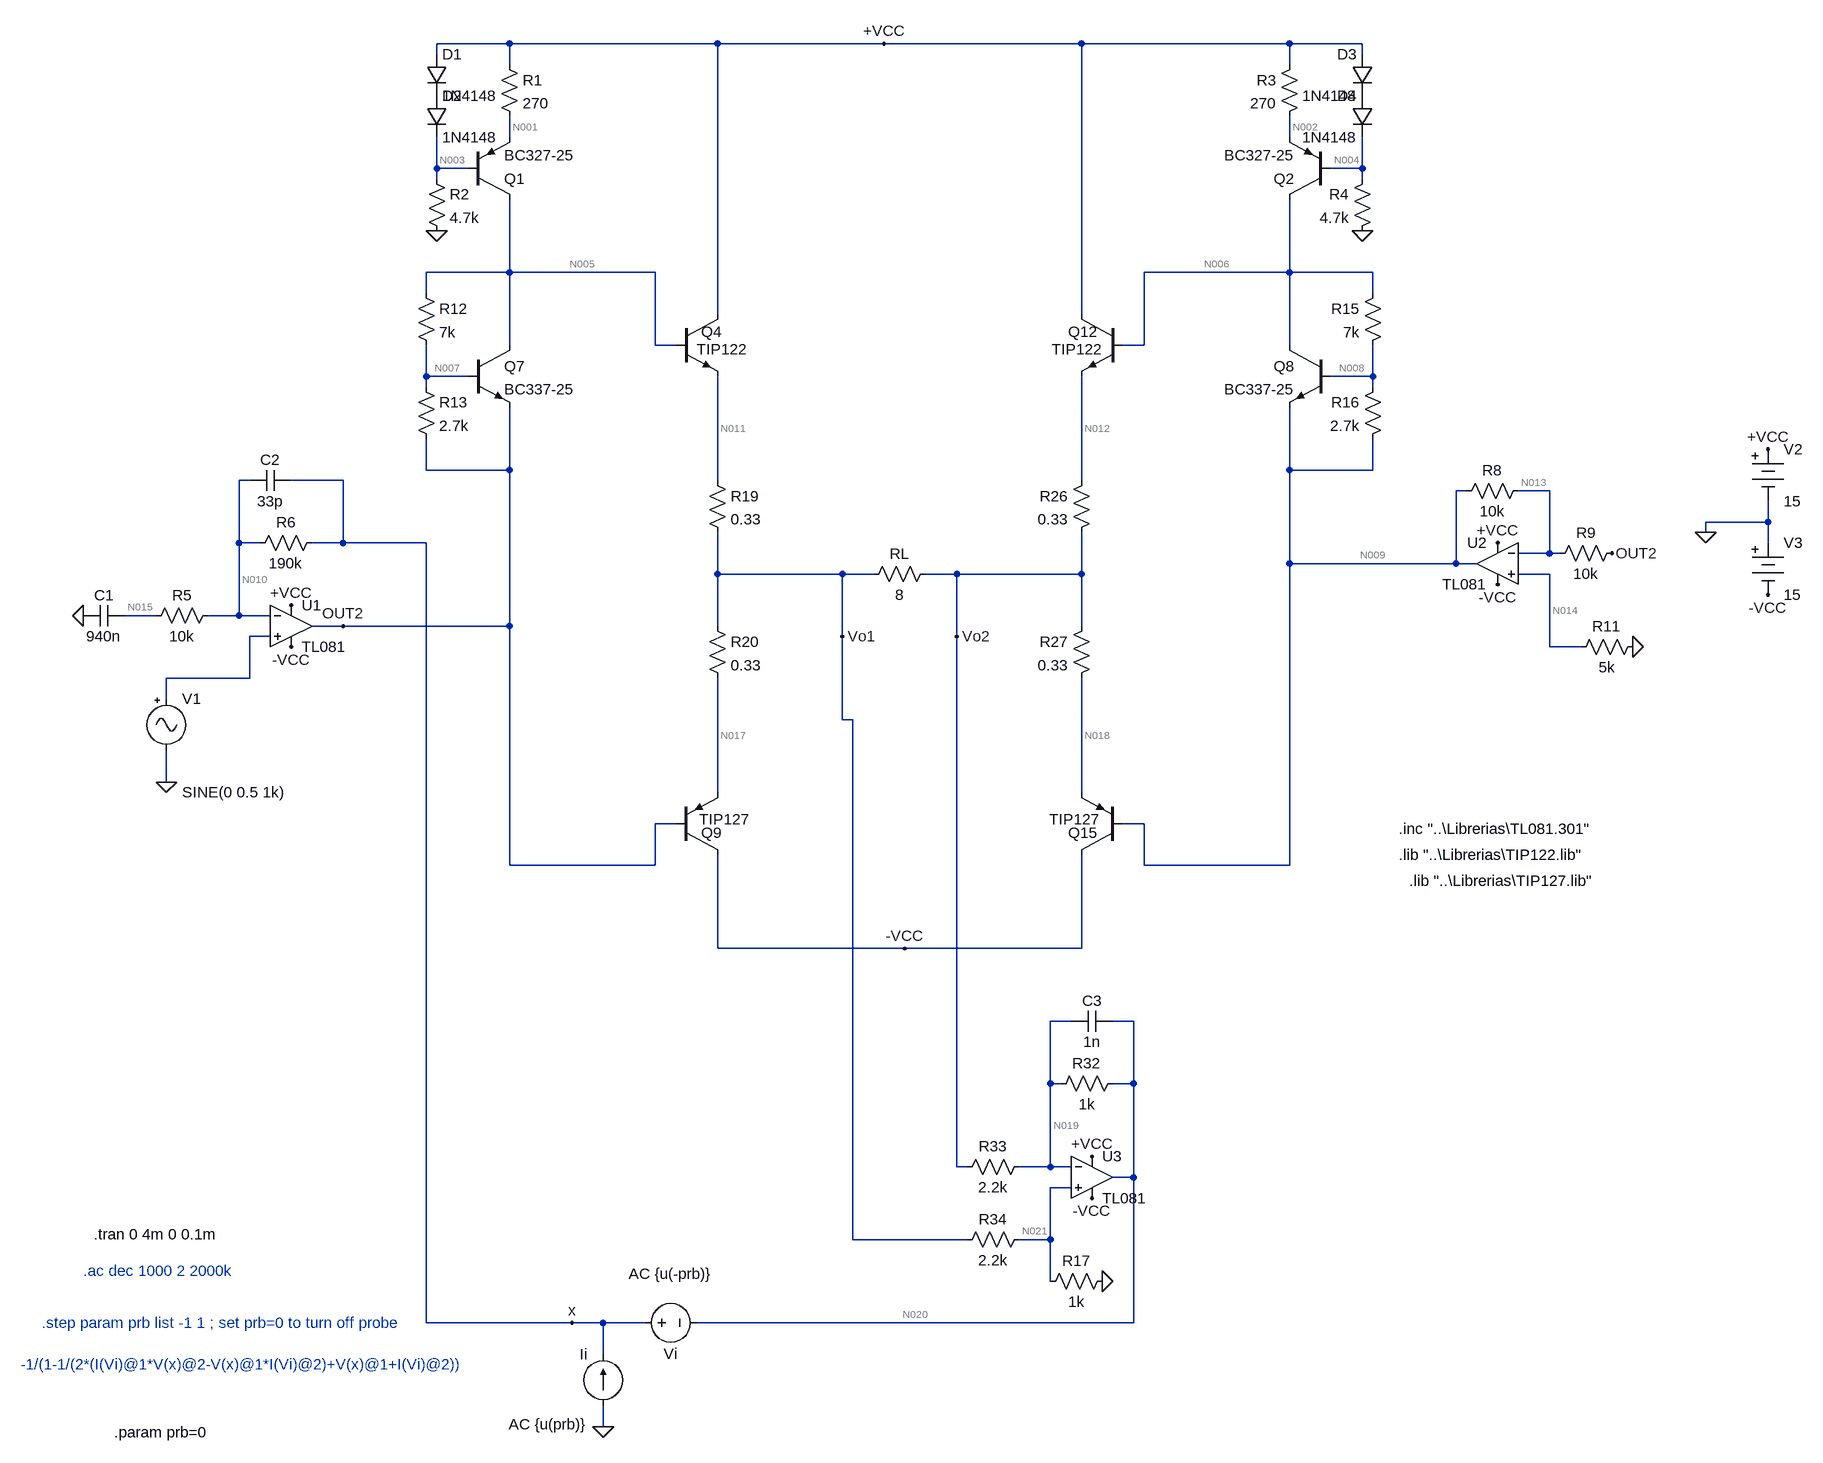
[diagram p0: schematic Amplificador.asc]
Amplificador.asc, the LTspice schematic file:
Version 4
SHEET 1 1564 2024
WIRE -608 -128 -720 -128
WIRE -288 -128 -608 -128
WIRE -32 -128 -288 -128
WIRE 272 -128 -32 -128
WIRE 592 -128 272 -128
WIRE 704 -128 592 -128
WIRE -720 -112 -720 -128
WIRE 704 -112 704 -128
WIRE -608 -96 -608 -128
WIRE 592 -96 592 -128
WIRE -608 16 -608 -16
WIRE 592 16 592 -16
WIRE -720 64 -720 16
WIRE -672 64 -720 64
WIRE 704 64 704 16
WIRE 704 64 656 64
WIRE -720 80 -720 64
WIRE 704 80 704 64
WIRE -608 224 -608 112
WIRE -608 224 -736 224
WIRE -384 224 -608 224
WIRE 592 224 592 112
WIRE 592 224 368 224
WIRE 720 224 592 224
WIRE -736 256 -736 224
WIRE 720 256 720 224
WIRE -288 288 -288 -128
WIRE 272 288 272 -128
WIRE -608 336 -608 224
WIRE -384 336 -384 224
WIRE -352 336 -384 336
WIRE 368 336 368 224
WIRE 368 336 336 336
WIRE 592 336 592 224
WIRE -736 384 -736 336
WIRE -672 384 -736 384
WIRE 720 384 720 336
WIRE 720 384 656 384
WIRE -736 400 -736 384
WIRE 720 400 720 384
WIRE -736 528 -736 480
WIRE -608 528 -608 432
WIRE -608 528 -736 528
WIRE 592 528 592 432
WIRE 720 528 720 480
WIRE 720 528 592 528
WIRE -1008 544 -1024 544
WIRE -864 544 -944 544
WIRE -288 544 -288 384
WIRE 272 544 272 384
WIRE 864 560 848 560
WIRE 992 560 944 560
WIRE 1328 608 1328 576
WIRE 1328 608 1232 608
WIRE 1232 624 1232 608
WIRE -1024 640 -1024 544
WIRE -992 640 -1024 640
WIRE -864 640 -864 544
WIRE -864 640 -912 640
WIRE -736 640 -864 640
WIRE 1328 640 1328 608
WIRE 992 656 992 560
WIRE 992 656 944 656
WIRE 1008 656 992 656
WIRE 592 672 592 528
WIRE 848 672 848 560
WIRE 848 672 592 672
WIRE 880 672 848 672
WIRE -288 688 -288 624
WIRE -96 688 -288 688
WIRE -48 688 -96 688
WIRE 80 688 32 688
WIRE 272 688 272 624
WIRE 272 688 80 688
WIRE 992 688 944 688
WIRE -1152 752 -1200 752
WIRE -1024 752 -1024 640
WIRE -1024 752 -1072 752
WIRE -976 752 -1024 752
WIRE -864 768 -912 768
WIRE -608 768 -608 528
WIRE -608 768 -864 768
WIRE -288 768 -288 688
WIRE 272 768 272 688
WIRE -976 784 -1008 784
WIRE -96 784 -96 688
WIRE 80 784 80 688
WIRE 992 800 992 688
WIRE 1040 800 992 800
WIRE -1008 848 -1008 784
WIRE -1008 848 -1136 848
WIRE -1136 880 -1136 848
WIRE -96 912 -96 784
WIRE -80 912 -96 912
WIRE -1136 1008 -1136 960
WIRE -288 1024 -288 848
WIRE 272 1024 272 848
WIRE -352 1072 -384 1072
WIRE 368 1072 336 1072
WIRE -608 1136 -608 768
WIRE -384 1136 -384 1072
WIRE -384 1136 -608 1136
WIRE 368 1136 368 1072
WIRE 592 1136 592 672
WIRE 592 1136 368 1136
WIRE -288 1264 -288 1120
WIRE 0 1264 -288 1264
WIRE 272 1264 272 1120
WIRE 272 1264 0 1264
WIRE 256 1376 224 1376
WIRE 352 1376 320 1376
WIRE 224 1472 224 1376
WIRE 240 1472 224 1472
WIRE 352 1472 352 1376
WIRE 352 1472 320 1472
WIRE 80 1600 80 784
WIRE 96 1600 80 1600
WIRE 224 1600 224 1472
WIRE 224 1600 176 1600
WIRE 256 1600 224 1600
WIRE 352 1616 352 1472
WIRE 352 1616 320 1616
WIRE 256 1632 224 1632
WIRE -80 1712 -80 912
WIRE 96 1712 -80 1712
WIRE 224 1712 224 1632
WIRE 224 1712 176 1712
WIRE 224 1776 224 1712
WIRE -736 1840 -736 640
WIRE -512 1840 -736 1840
WIRE -464 1840 -512 1840
WIRE -400 1840 -464 1840
WIRE 352 1840 352 1616
WIRE 352 1840 -320 1840
WIRE -464 1888 -464 1840
WIRE -464 2000 -464 1968
FLAG -720 160 0
FLAG -864 768 OUT2
FLAG 1088 656 OUT2
FLAG 704 160 0
FLAG 1232 624 0
FLAG 1328 496 +VCC
FLAG 1328 720 -VCC
FLAG -944 736 +VCC
FLAG 912 640 +VCC
FLAG 288 1584 +VCC
FLAG -32 -128 +VCC
FLAG -96 784 Vo1
FLAG 80 784 Vo2
FLAG -464 2000 0
FLAG -512 1840 x
FLAG 1120 800 0
FLAG 304 1776 0
FLAG 0 1264 -VCC
FLAG -944 800 -VCC
FLAG 288 1648 -VCC
FLAG 912 704 -VCC
FLAG -1136 1008 0
FLAG -1264 752 0
SYMBOL pnp -672 112 M180
SYMATTR InstName Q1
SYMATTR Value BC327-25
SYMBOL diode -736 -112 R0
SYMATTR InstName D1
SYMATTR Value 1N4148
SYMBOL diode -736 -48 R0
SYMATTR InstName D2
SYMATTR Value 1N4148
SYMBOL res -624 -112 R0
SYMATTR InstName R1
SYMATTR Value 270
SYMBOL res -736 64 R0
SYMATTR InstName R2
SYMATTR Value 4.7k
SYMBOL Opamps\\opamp2 -944 704 R0
SYMATTR InstName U1
SYMATTR Value TL081
SYMATTR SpiceModel TL081
SYMBOL Opamps\\opamp2 912 608 M0
SYMATTR InstName U2
SYMATTR Value TL081
SYMATTR SpiceModel TL081
SYMBOL res -896 624 R90
WINDOW 0 0 56 VBottom 2
WINDOW 3 32 56 VTop 2
SYMATTR InstName R6
SYMATTR Value 190k
SYMBOL res 960 544 R90
WINDOW 0 0 56 VBottom 2
WINDOW 3 32 56 VTop 2
SYMATTR InstName R8
SYMATTR Value 10k
SYMBOL res 1104 640 R90
WINDOW 0 0 56 VBottom 2
WINDOW 3 32 56 VTop 2
SYMATTR InstName R9
SYMATTR Value 10k
SYMBOL npn -672 336 R0
SYMATTR InstName Q7
SYMATTR Value BC337-25
SYMBOL res -752 240 R0
SYMATTR InstName R12
SYMATTR Value 7k
SYMBOL res -752 384 R0
SYMATTR InstName R13
SYMATTR Value 2.7k
SYMBOL npn -352 288 R0
WINDOW 0 39 27 Left 2
WINDOW 3 32 54 Left 2
SYMATTR InstName Q4
SYMATTR Value TIP122
SYMATTR Prefix X
SYMBOL res -304 528 R0
SYMATTR InstName R19
SYMATTR Value 0.33
SYMBOL res -304 752 R0
SYMATTR InstName R20
SYMATTR Value 0.33
SYMBOL pnp -352 1120 M180
WINDOW 0 39 34 Left 2
WINDOW 3 36 55 Left 2
SYMATTR InstName Q9
SYMATTR Value TIP127
SYMATTR Prefix X
SYMBOL pnp 656 112 R180
SYMATTR InstName Q2
SYMATTR Value BC327-25
SYMBOL diode 720 -112 M0
SYMATTR InstName D3
SYMATTR Value 1N4148
SYMBOL diode 720 -48 M0
SYMATTR InstName D4
SYMATTR Value 1N4148
SYMBOL res 608 -112 M0
SYMATTR InstName R3
SYMATTR Value 270
SYMBOL res 720 64 M0
SYMATTR InstName R4
SYMATTR Value 4.7k
SYMBOL npn 656 336 M0
SYMATTR InstName Q8
SYMATTR Value BC337-25
SYMBOL res 736 240 M0
SYMATTR InstName R15
SYMATTR Value 7k
SYMBOL res 736 384 M0
SYMATTR InstName R16
SYMATTR Value 2.7k
SYMBOL npn 336 288 M0
WINDOW 0 39 27 Left 2
WINDOW 3 32 54 Left 2
SYMATTR InstName Q12
SYMATTR Value TIP122
SYMATTR Prefix X
SYMBOL res 288 528 M0
SYMATTR InstName R26
SYMATTR Value 0.33
SYMBOL res 288 752 M0
SYMATTR InstName R27
SYMATTR Value 0.33
SYMBOL pnp 336 1120 R180
WINDOW 0 39 34 Left 2
WINDOW 3 36 55 Left 2
SYMATTR InstName Q15
SYMATTR Value TIP127
SYMATTR Prefix X
SYMBOL res 48 672 R90
WINDOW 0 0 56 VBottom 2
WINDOW 3 32 56 VTop 2
SYMATTR InstName RL
SYMATTR Value 8
SYMBOL Opamps\\opamp2 288 1552 R0
SYMATTR InstName U3
SYMATTR Value TL081
SYMATTR SpiceModel TL081
SYMBOL res 336 1456 R90
WINDOW 0 0 56 VBottom 2
WINDOW 3 32 56 VTop 2
SYMATTR InstName R32
SYMATTR Value 1k
SYMBOL res 192 1584 R90
WINDOW 0 0 56 VBottom 2
WINDOW 3 32 56 VTop 2
SYMATTR InstName R33
SYMATTR Value 2.2k
SYMBOL res 192 1696 R90
WINDOW 0 0 56 VBottom 2
WINDOW 3 32 56 VTop 2
SYMATTR InstName R34
SYMATTR Value 2.2k
SYMBOL Misc\\battery 1328 480 R0
WINDOW 123 0 0 Left 2
WINDOW 39 0 0 Left 2
SYMATTR InstName V2
SYMATTR Value 15
SYMBOL Misc\\battery 1328 624 R0
WINDOW 123 0 0 Left 2
WINDOW 39 0 0 Left 2
SYMATTR InstName V3
SYMATTR Value 15
SYMBOL cap 256 1360 M90
WINDOW 0 0 32 VBottom 2
WINDOW 3 32 32 VTop 2
SYMATTR InstName C3
SYMATTR Value 1n
SYMBOL current -464 1968 R180
WINDOW 0 24 80 Left 2
WINDOW 3 24 0 Left 2
WINDOW 123 24 -28 Left 2
WINDOW 39 0 0 Left 2
SYMATTR InstName Ii
SYMATTR Value ""
SYMATTR Value2 AC {u(prb)}
SYMBOL voltage -416 1840 R270
WINDOW 0 -32 56 VBottom 2
WINDOW 3 32 56 VTop 2
WINDOW 123 60 56 VTop 2
WINDOW 39 0 0 Left 2
SYMATTR InstName Vi
SYMATTR Value ""
SYMATTR Value2 AC {u(-prb)}
SYMBOL res 1136 784 R90
WINDOW 0 0 56 VBottom 2
WINDOW 3 32 56 VTop 2
SYMATTR InstName R11
SYMATTR Value 5k
SYMBOL res 320 1760 R90
WINDOW 0 0 56 VBottom 2
WINDOW 3 32 56 VTop 2
SYMATTR InstName R17
SYMATTR Value 1k
SYMBOL res -1056 736 R90
WINDOW 0 0 56 VBottom 2
WINDOW 3 32 56 VTop 2
SYMATTR InstName R5
SYMATTR Value 10k
SYMBOL cap -1200 736 R90
WINDOW 0 0 32 VBottom 2
WINDOW 3 32 32 VTop 2
SYMATTR InstName C1
SYMATTR Value 940n
SYMBOL cap -944 528 R90
WINDOW 0 0 32 VBottom 2
WINDOW 3 32 32 VTop 2
SYMATTR InstName C2
SYMATTR Value 33p
SYMBOL Misc\\signal -1136 864 R0
WINDOW 3 24 160 Left 2
WINDOW 123 24 132 Left 2
WINDOW 39 0 0 Left 2
SYMATTR Value SINE(0 0.5 1k)
SYMATTR InstName V1
TEXT -1248 1704 Left 2 !.tran 0 4m 0 0.1m
TEXT 760 1080 Left 2 !.inc "..\\Librerias\\TL081.301"
TEXT 760 1120 Left 2 !.lib "..\\Librerias\\TIP122.lib"
TEXT 776 1160 Left 2 !.lib "..\\Librerias\\TIP127.lib"
TEXT -1264 1760 Left 2 ;.ac dec 1000 2 2000k
TEXT -1328 1840 Left 2 ;.step param prb list -1 1 ; set prb=0 to turn off probe
TEXT -1360 1904 Left 2 ;-1/(1-1/(2*(I(Vi)@1*V(x)@2-V(x)@1*I(Vi)@2)+V(x)@1+I(Vi)@2))
TEXT -1216 2008 Left 2 !.param prb=0

The netlist it stands for:
* Amplificador.asc
Q1 N005 N003 N001 0 BC327-25
D1 +VCC P001 1N4148
D2 P001 N003 1N4148
R1 +VCC N001 270
R2 N003 0 4.7k
XU1 N016 N010 +VCC -VCC OUT2 TL081 TL081  ; pins In+ In- V+ V- OUT
XU2 N014 N013 +VCC -VCC N009 TL081 TL081  ; pins In+ In- V+ V- OUT
R6 x N010 190k
R8 N013 N009 10k
R9 OUT2 N013 10k
Q7 N005 N007 OUT2 0 BC337-25
R12 N005 N007 7k
R13 N007 OUT2 2.7k
XQ4 +VCC N005 N011 TIP122  ; pins C B E
R19 N011 Vo1 0.33
R20 Vo1 N017 0.33
XQ9 -VCC OUT2 N017 TIP127  ; pins C B E
Q2 N006 N004 N002 0 BC327-25
D3 +VCC P002 1N4148
D4 P002 N004 1N4148
R3 +VCC N002 270
R4 N004 0 4.7k
Q8 N006 N008 N009 0 BC337-25
R15 N006 N008 7k
R16 N008 N009 2.7k
XQ12 +VCC N006 N012 TIP122  ; pins C B E
R26 N012 Vo2 0.33
R27 Vo2 N018 0.33
XQ15 -VCC N009 N018 TIP127  ; pins C B E
RL Vo2 Vo1 8
XU3 N021 N019 +VCC -VCC N020 TL081 TL081  ; pins In+ In- V+ V- OUT
R32 N020 N019 1k
R33 N019 Vo2 2.2k
R34 N021 Vo1 2.2k
V2 +VCC 0 15
V3 0 -VCC 15
C3 N019 N020 1n
Ii 0 x AC {u(prb)}
Vi x N020 AC {u(-prb)}
R11 0 N014 5k
R17 0 N021 1k
R5 N010 N015 10k
C1 N015 0 940n
C2 x N010 33p
V1 N016 0 SINE(0 0.5 1k)
.model D D
.lib standard.dio
.model NPN NPN
.model PNP PNP
.lib standard.bjt
.tran 0 4m 0 0.1m
.inc "..\Librerias\TL081.301"
.lib "..\Librerias\TIP122.lib"
.lib "..\Librerias\TIP127.lib"
* .ac dec 1000 2 2000k
* .step param prb list -1 1 ; set prb=0 to turn off probe
* -1/(1-1/(2*(I(Vi)@1*V(x)@2-V(x)@1*I(Vi)@2)+V(x)@1+I(Vi)@2))
.param prb=0
.backanno
.end

* Results of the author's LTspice run, read from the files saved beside the schematic
* Operating Point, zero values left out:
*   V(n005) = 2.308 V
*   V(n003) = 13.73 V
*   V(n001) = 14.34 V
*   V(+vcc) = 15 V
*   V(p001) = 14.37 V
*   V(out2) = 41.76 µV
*   V(-vcc) = -15 V
*   V(n010) = 14.21 µV
*   V(n009) = -13.35 µV
*   V(n013) = 13.98 µV
*   V(n014) = -225.3 nV
*   V(x) = 22.77 µV
*   V(n007) = 627.7 mV
*   V(n011) = 1.161 V
*   V(vo1) = 1.153 V
*   V(n017) = 1.145 V
*   V(n006) = 2.308 V
*   V(n004) = 13.73 V
*   V(n002) = 14.34 V
*   V(p002) = 14.37 V
*   V(n008) = 627.6 mV
*   V(n012) = 1.161 V
*   V(vo2) = 1.153 V
*   V(n018) = 1.145 V
*   V(n020) = 22.77 µV
*   V(n019) = 360.3 mV
*   V(n021) = 360.3 mV
*   V(n015) = 14.21 µV
*   Ic(Q8) = 2.113 mA
*   Ib(Q8) = 7.611 µA
*   Ie(Q8) = -2.12 mA
*   Ic(Q7) = 2.113 mA
*   Ib(Q7) = 7.611 µA
*   Ie(Q7) = -2.12 mA
*   Ic(Q2) = -2.456 mA
*   Ib(Q2) = -5.347 µA
*   Ie(Q2) = 2.461 mA
*   Ic(Q1) = -2.456 mA
*   Ib(Q1) = -5.347 µA
*   Ie(Q1) = 2.461 mA
*   I(D4) = 2.916 mA
*   I(D3) = 2.916 mA
*   I(D2) = 2.916 mA
*   I(D1) = 2.916 mA
*   I(R17) = -360.3 µA
*   I(R11) = 45.05 pA
*   I(R34) = -360.3 µA
*   I(R33) = -360.2 µA
*   I(R32) = -360.2 µA
*   I(Rl) = -5.643 µA
*   I(R27) = 24.26 mA
*   I(R26) = 24.61 mA
*   I(R16) = 232.5 µA
*   I(R15) = 240.1 µA
*   I(R4) = 2.922 mA
*   I(R3) = 2.461 mA
*   I(R20) = 24.25 mA
*   I(R19) = 24.62 mA
*   I(R13) = 232.5 µA
*   I(R12) = 240.1 µA
*   I(R9) = 2.778 nA
*   I(R8) = 2.733 nA
*   I(R6) = 45.05 pA
*   I(R2) = 2.922 mA
*   I(R1) = 2.461 mA
*   I(V1) = -45.05 pA
*   I(Vi) = -45.05 pA
*   I(V3) = -90.86 mA
*   I(V2) = -102.4 mA
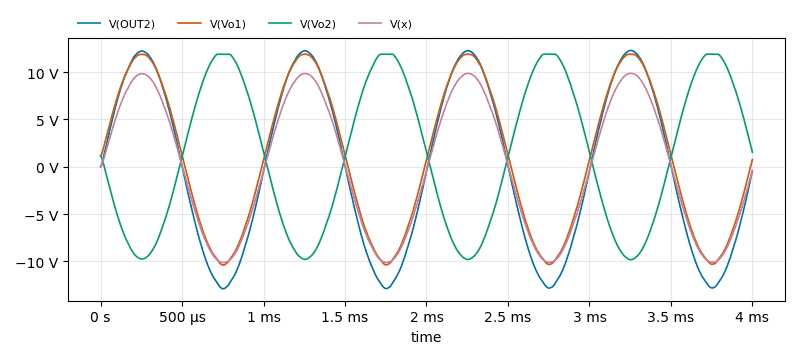
[diagram p1: Transient Analysis of Amplificador.asc, plotted from the saved traces]
* Transient Analysis, 1 run:
*   V(OUT2): min -12.89 V, max 12.29 V, average -177.3 mV, rms 8.774 V, last -457.6 mV
*   V(Vo1): min -10.38 V, max 11.88 V, average 957.3 mV, rms 7.837 V, last 771.1 mV
*   V(Vo2): min -9.819 V, max 11.89 V, average 1.244 V, rms 7.831 V, last 1.537 V
*   V(x): min -10.12 V, max 9.863 V, average -130.4 mV, rms 7.05 V, last -393.6 mV